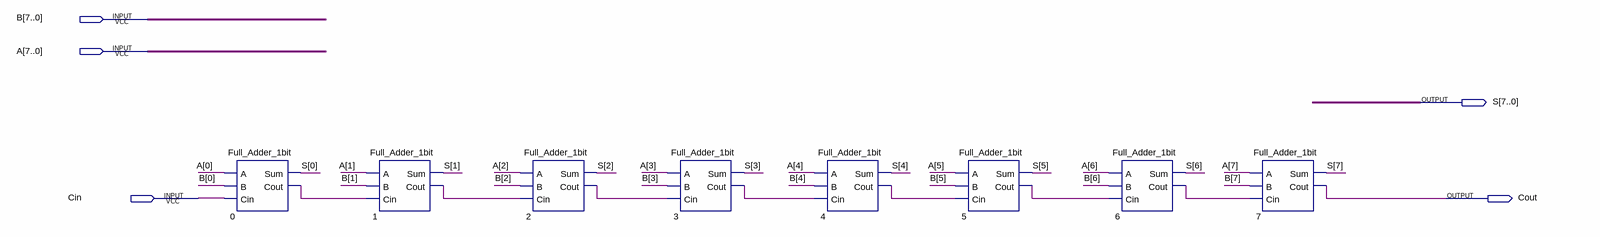
[diagram p0: schematic sheet]
// Quartus schematic FULL_ADDER_8BIT.bdf as structural Verilog: 8 symbols, 5 pins
module FULL_ADDER_8BIT (
  input  [7:0] B,
  input  [7:0] A,
  input  Cin,
  output [7:0] S,
  output Cout
);

  wire n0_cout, n1_cout, n2_cout, n3_cout, n4_cout, n5_cout, n6_cout;

  Full_Adder_1bit u_0 (.A(A[0]), .B(B[0]), .Cin(Cin), .Sum(S[0]), .Cout(n0_cout));
  Full_Adder_1bit u_1 (.A(A[1]), .B(B[1]), .Cin(n0_cout), .Sum(S[1]), .Cout(n1_cout));
  Full_Adder_1bit u_2 (.A(A[2]), .B(B[2]), .Cin(n1_cout), .Sum(S[2]), .Cout(n2_cout));
  Full_Adder_1bit u_3 (.A(A[3]), .B(B[3]), .Cin(n2_cout), .Sum(S[3]), .Cout(n3_cout));
  Full_Adder_1bit u_4 (.A(A[4]), .B(B[4]), .Cin(n3_cout), .Sum(S[4]), .Cout(n4_cout));
  Full_Adder_1bit u_5 (.A(A[5]), .B(B[5]), .Cin(n4_cout), .Sum(S[5]), .Cout(n5_cout));
  Full_Adder_1bit u_6 (.A(A[6]), .B(B[6]), .Cin(n5_cout), .Sum(S[6]), .Cout(n6_cout));
  Full_Adder_1bit u_7 (.A(A[7]), .B(B[7]), .Cin(n6_cout), .Sum(S[7]), .Cout(Cout));
endmodule
